# Altium schematic sheet [8] I2C_Control.SchDoc: =DocumentName
size A3; Organization: ORGANIZATION; Address1: R. Aprígio Veloso, 882, Universitário; Address2: Campina Grande - PB; Address3: 58429-900; DocumentNumber: 8; Revision: -; SheetNumber: 8; SheetTotal: 8; ENG_DATE: --/--/--; DSN_DATE: --/--/--; CHK_DATE: --/--/--; SCH_SCALE: 1:1
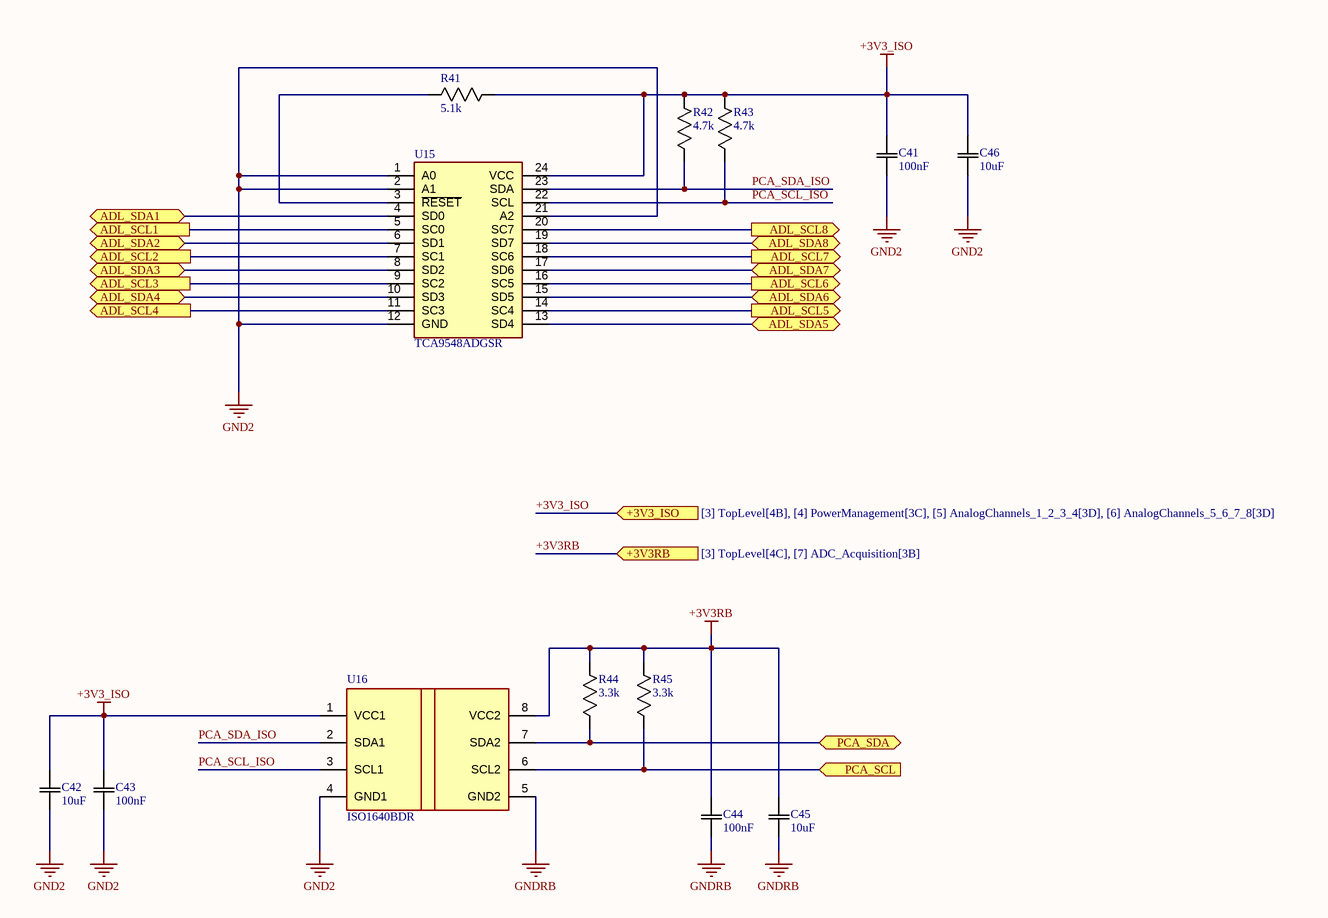
[diagram p0: [8] I2C_Control.SchDoc]

## Parts
C41  value 100nF  [CAPC1005X40N]  (hidden comment: GCM155R71H104KE02D)
C42  value 10uF  [CAPC1005X40N]  (hidden comment: GRM155R61A102KA01D)
C43  value 100nF  [CAPC1005X40N]  (hidden comment: GCM155R71H104KE02D)
C44  value 100nF  [CAPC1005X40N]  (hidden comment: GCM155R71H104KE02D)
C45  value 10uF  [CAPC1005X40N]  (hidden comment: GRM155R61A102KA01D)
C46  value 10uF  [CAPC1005X40N]  (hidden comment: GRM155R61A102KA01D)
R41  value 5.1k  [RESC1005X40N]  (hidden comment: RC0402FR-075K1L)
R42  value 4.7k  [RESC1005X40N]  (hidden comment: RC0402FR-074K7L)
R43  value 4.7k  [RESC1005X40N]  (hidden comment: RC0402FR-074K7L)
R44  value 3.3k  [RESC1005X40N]  (hidden comment: RC0402FR-073K3L)
R45  value 3.3k  [RESC1005X40N]  (hidden comment: RC0402FR-073K3L)
U15  TCA9548ADGSR  [SOP50P490X110-24N]
U16  ISO1640BDR  [SOIC127P600X175-8N]

## Ports
+3V3_ISO (in, see [3] TopLevel[4B], [4] PowerManagement[3C], [5] AnalogChannels_1_2_3_4[3D], [6] AnalogChannels_5_6_7_8[3D]), +3V3RB (in, see [3] TopLevel[4C], [7] ADC_Acquisition[3B]), ADL_SCL1 (out, see [3] TopLevel[5B], [5] AnalogChannels_1_2_3_4[1A]), ADL_SCL2 (out, see [3] TopLevel[5B], [5] AnalogChannels_1_2_3_4[5A]), ADL_SCL3 (out, see [3] TopLevel[5B], [5] AnalogChannels_1_2_3_4[1C]), ADL_SCL4 (out, see [3] TopLevel[5B], [5] AnalogChannels_1_2_3_4[5C]), ADL_SCL5 (out, see [3] TopLevel[5C], [6] AnalogChannels_5_6_7_8[1A]), ADL_SCL6 (out, see [3] TopLevel[5C], [6] AnalogChannels_5_6_7_8[5A]), ADL_SCL7 (out, see [3] TopLevel[5C], [6] AnalogChannels_5_6_7_8[1C]), ADL_SCL8 (out, see [3] TopLevel[5C], [6] AnalogChannels_5_6_7_8[5C]), ADL_SDA1 (bidir, see [3] TopLevel[5B], [5] AnalogChannels_1_2_3_4[1A]), ADL_SDA2 (bidir, see [3] TopLevel[5B], [5] AnalogChannels_1_2_3_4[5A]), ADL_SDA3 (bidir, see [3] TopLevel[5B], [5] AnalogChannels_1_2_3_4[1C]), ADL_SDA4 (bidir, see [3] TopLevel[5B], [5] AnalogChannels_1_2_3_4[5C]), ADL_SDA5 (bidir, see [3] TopLevel[5C], [6] AnalogChannels_5_6_7_8[1A]), ADL_SDA6 (bidir, see [3] TopLevel[5C], [6] AnalogChannels_5_6_7_8[5A]), ADL_SDA7 (bidir, see [3] TopLevel[5C], [6] AnalogChannels_5_6_7_8[1C]), ADL_SDA8 (bidir, see [3] TopLevel[5C], [6] AnalogChannels_5_6_7_8[5C]), PCA_SCL (in, see [3] TopLevel[4C]), PCA_SDA (bidir, see [3] TopLevel[4C])

## Nets
+3V3_ISO: C41.2 C42.2 C43.2 C46.2 R41.1 R42.1 R43.1 U15.24(VCC) U16.1(VCC1) ; port +3V3_ISO
+3V3RB: C44.2 C45.2 R44.1 R45.1 U16.8(VCC2) ; port +3V3RB
GND2: C41.1 C42.1 C43.1 C46.1 U15.1(A0) U15.2(A1) U15.12(GND) U15.21(A2) U16.4(GND1)
GNDRB: C44.1 C45.1 U16.5(GND2)
ADL_SCL1: U15.5(SC0) ; port ADL_SCL1
ADL_SCL2: U15.7(SC1) ; port ADL_SCL2
ADL_SCL3: U15.9(SC2) ; port ADL_SCL3
ADL_SCL4: U15.11(SC3) ; port ADL_SCL4
ADL_SCL5: U15.14(SC4) ; port ADL_SCL5
ADL_SCL6: U15.16(SC5) ; port ADL_SCL6
ADL_SCL7: U15.18(SC6) ; port ADL_SCL7
ADL_SCL8: U15.20(SC7) ; port ADL_SCL8
ADL_SDA1: U15.4(SD0) ; port ADL_SDA1
ADL_SDA2: U15.6(SD1) ; port ADL_SDA2
ADL_SDA3: U15.8(SD2) ; port ADL_SDA3
ADL_SDA4: U15.10(SD3) ; port ADL_SDA4
ADL_SDA5: U15.13(SD4) ; port ADL_SDA5
ADL_SDA6: U15.15(SD5) ; port ADL_SDA6
ADL_SDA7: U15.17(SD6) ; port ADL_SDA7
ADL_SDA8: U15.19(SD7) ; port ADL_SDA8
PCA_SCL: R45.2 U16.6(SCL2) ; port PCA_SCL
PCA_SCL_ISO: R43.2 U15.22(SCL) U16.3(SCL1)
PCA_SDA: R44.2 U16.7(SDA2) ; port PCA_SDA
PCA_SDA_ISO: R42.2 U15.23(SDA) U16.2(SDA1)
NetR41_2: R41.2 U15.3(~{RESET})

## Notes on the sheet
- REVISION
- DESCRIPTION
- DATE
- APPROVED
- ADDRESS
- PROJECT
- VERSION
- TITLE
- A3
- SIZE
- SCALE
- DOCUMENT NAME:
- DOCUMENT REVISION:
- OF
- SHEET:
- PROJECT REVISION:

## Library data of the parts
C41 C43 C44 = GCM155R71H104KE02D: 0.1 µF ±10% 50V Ceramic Capacitor X7R 0402 (1005 Metric); Manufacturer_Name: Murata; Copyright: Copyright (C) 2026 Ultra Librarian. All rights reserved.; Manufacturer_Part_Number: GCM155R71H104KE02D; Supplier 1: DigiKey; Supplier Part Number 1: 490-10672-1-ND; Datasheet Link: https://search.murata.co.jp/Ceramy/image/img/A01X/G101/ENG/GCM155R71H104KE02-01.pdf
C42 C45 C46 = GRM155R61A102KA01D: 1000 pF ±10% 10V Ceramic Capacitor X5R 0402 (1005 Metric); Manufacturer_Name: Murata; Copyright: Copyright (C) 2026 Ultra Librarian. All rights reserved.; Manufacturer_Part_Number: GRM155R61A102KA01D; Supplier 1: DigiKey; Supplier Part Number 1: 490-6295-1-ND
R41 = RC0402FR-075K1L: 5.1 kOhms ±1% 0.063W, 1/16W Chip Resistor 0402 (1005 Metric) Moisture Resistant Thick Film; Manufacturer_Name: Yageo; Copyright: Copyright (C) 2025 Ultra Librarian. All rights reserved.; Manufacturer_Part_Number: RC0402FR-075K1L; Supplier: Digikey; Supplier 1: DigiKey; Supplier Part Number 1: 311-5.10KLRDKR-ND; Datasheet Link: https://yageogroup.com/content/datasheet/asset/file/PYU-RC_GROUP_51_ROHS_L
R42 R43 = RC0402FR-074K7L: 4.7 kOhms ±1% 0.063W, 1/16W Chip Resistor 0402 (1005 Metric) Moisture Resistant Thick Film; Manufacturer_Name: Yageo; Copyright: Copyright (C) 2025 Ultra Librarian. All rights reserved.; Manufacturer_Part_Number: RC0402FR-074K7L; Supplier: Digikey; Supplier 1: DigiKey; Supplier Part Number 1: 311-4.7KLRCT-ND; Datasheet Link: https://yageogroup.com/content/datasheet/asset/file/PYU-RC_GROUP_51_ROHS_L
R44 R45 = RC0402FR-073K3L: 3.3 kOhms ±1% 0.063W, 1/16W Chip Resistor 0402 (1005 Metric) Moisture Resistant Thick Film; Manufacturer_Name: Yageo; Copyright: Copyright (C) 2025 Ultra Librarian. All rights reserved.; Manufacturer_Part_Number: RC0402FR-073K3L; Supplier: Digikey; Supplier 1: DigiKey; Supplier Part Number 1: 311-3.30KLRCT-ND; Datasheet Link: https://yageogroup.com/content/datasheet/asset/file/PYU-RC_GROUP_51_ROHS_L
U15 = TCA9548ADGSR: IC BUS SWITCH 2 X 1:8 24-VSSOP; Manufacturer_Name: Texas Instruments; Datasheet Link: https://www.ti.com/lit/ds/symlink/tca9548a.pdf?ts=1738746169750&ref_url=https%253A%252F%252Fwww.mouser.de%252F; Height: 1.1mm; Manufacturer_Part_Number: TCA9548ADGSR; Mouser Part Number: 595-TCA9548ADGSR; Mouser Price/Stock: https://www.mouser.co.uk/ProductDetail/Texas-Instruments/TCA9548ADGSR?qs=olJun0bQHM%252B7USbLxm4jDw%3D%3D; Arrow Part Number: TCA9548ADGSR; Arrow Price/Stock: https://www.arrow.com/en/products/tca9548adgsr/texas-instruments.html?utm_currency=USD&region=nac; Supplier 1: Digikey; Supplier Part Number 1: 296-TCA9548ADGSRCT-ND; Value: TCA9548ADGSR
U16 = ISO1640BDR: Hot-swappable, robust-EMC bidirectional I2C isolator with bidirectional clock 8-SOIC -40 to 125; Manufacturer_Name: Texas Instruments; TYPE: TYPE; RefDes: RefDes; Copyright: Copyright (C) 2026 Ultra Librarian. All rights reserved.; Manufacturer_Part_Number: ISO1640BDR; Supplier 1: DigiKey; Supplier Part Number 1: 296-ISO1640BDRCT-ND; Value: ISO1640BDR; Datasheet Link: https://www.ti.com/lit/ds/symlink/iso1640.pdf